# EAGLE schematic Final Thesis (EAGLE 7.5.0)
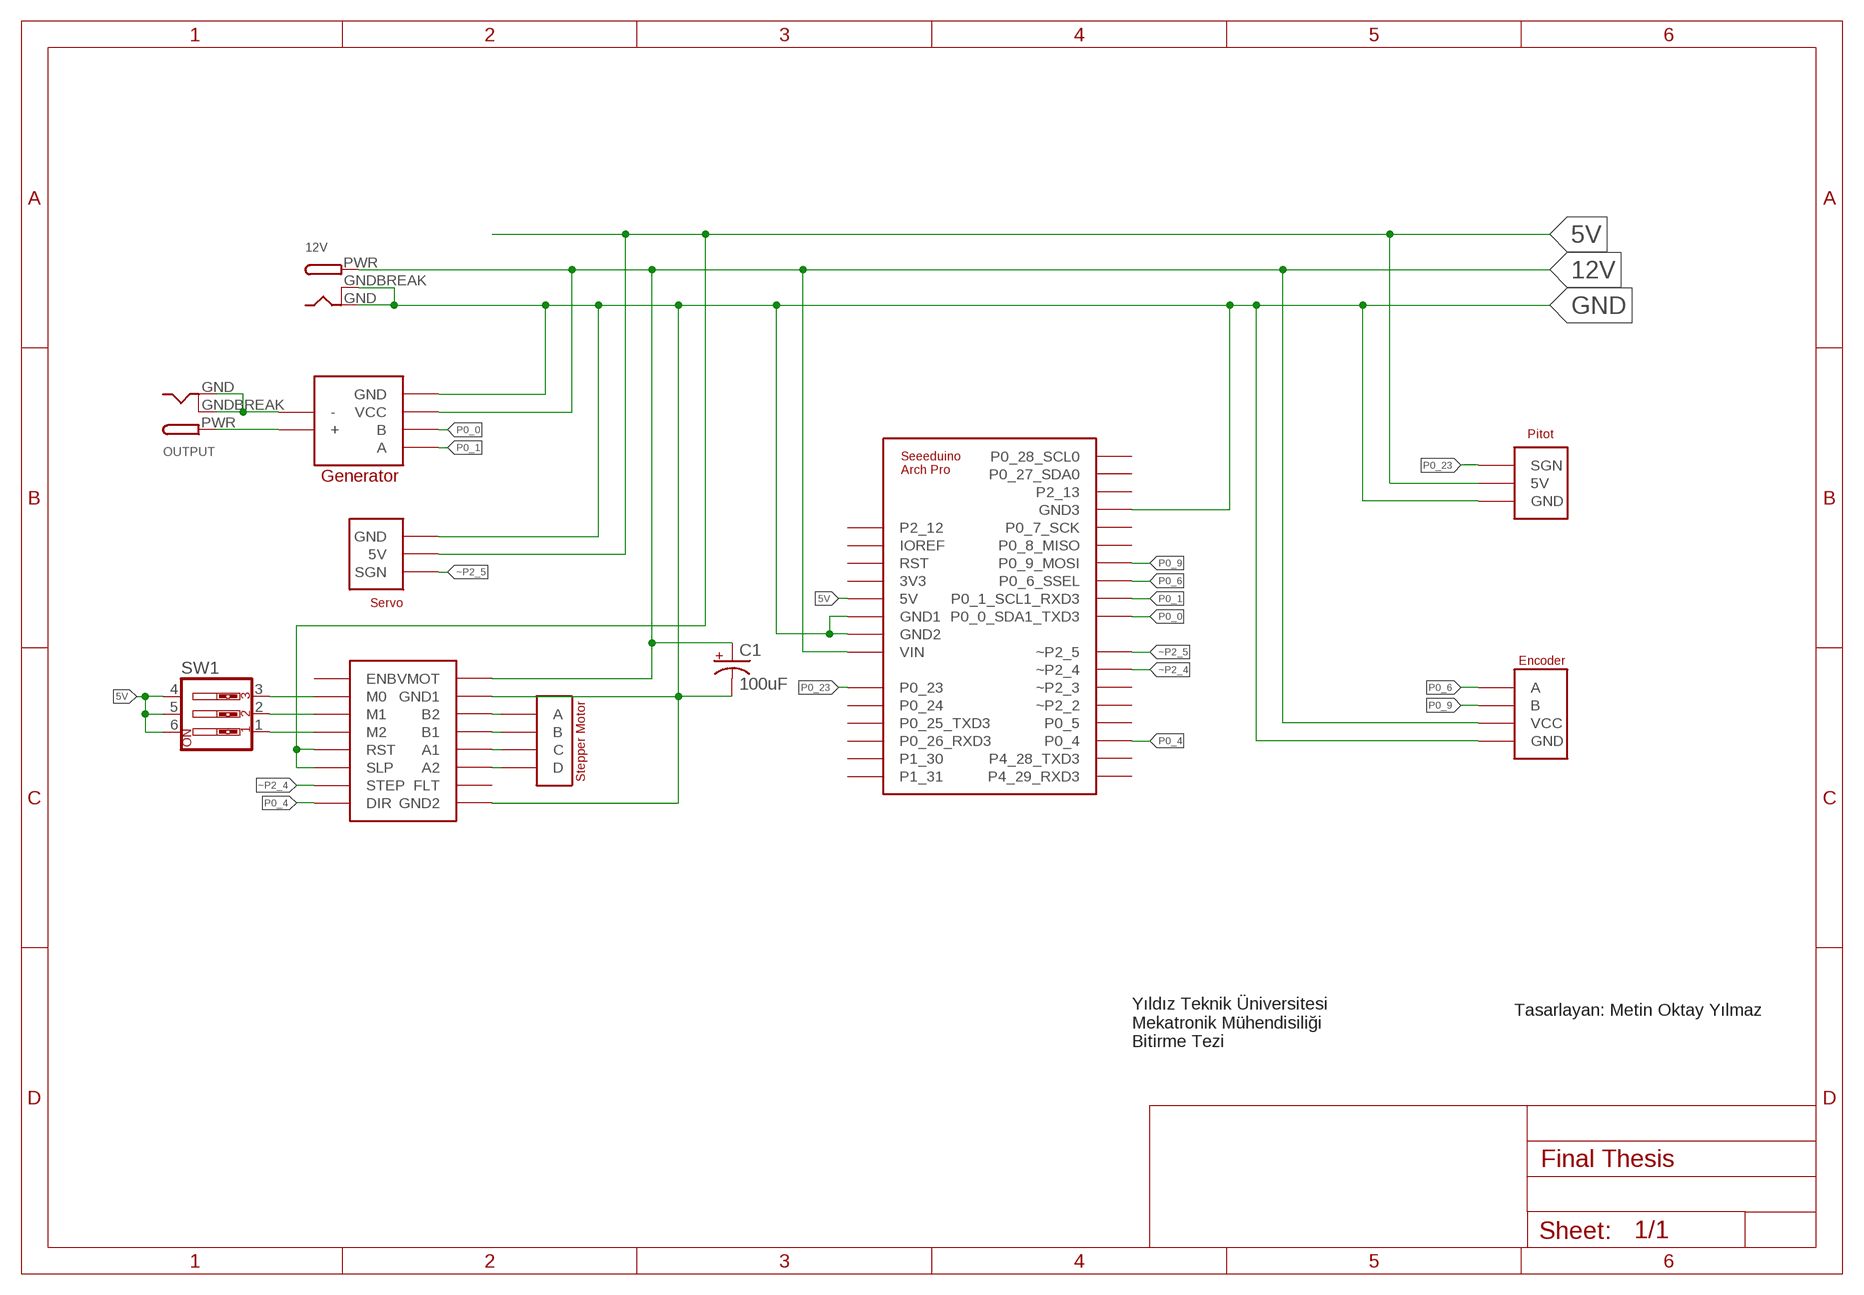
[diagram p0: schematic, sheet 1]

## Parts
12V  DCBARRELPTH  [DCJACK_2MM_PTH]
C1  100uF  CAP_POLPTH1  [CPOL-RADIAL-100UF-25V]
OUTPUT  DCBARRELPTH  [DCJACK_2MM_PTH]
SAP1  ARCH_PROSHIELD  [ARCH_PRO]
SW1  SW_DIP-3  [EDG-03]
U$1  ENCODER  [ENCODER]
U$2  GENERATOR  [GENERATOR]
U$3  PITOT  [PITOT]
U$4  SERVO  [SERVO]
U$5  STEPPER  [STEPPER]
U$6  STEPPER_DRIVER  [STEPPER_DRIVER]

## Nets
5V: SAP1.5V SW1.4 SW1.5 SW1.6 U$3.5V U$4.5V U$6.RST U$6.SLP
12V: 12V.PWR C1.1(+) SAP1.VIN U$1.VCC U$2.VCC U$6.VMOT
GND: 12V.GND 12V.GNDBREAK C1.2(-) SAP1.GND1 SAP1.GND2 SAP1.GND3 U$1.GND U$2.GND U$3.GND U$4.GND U$6.GND1(GND2) U$6.GND(GND1)
N$1: U$5.A U$6.B2
N$2: U$5.B U$6.B1
N$3: U$5.C U$6.A1
N$4: U$5.D U$6.A2
N$6: OUTPUT.PWR U$2.+
N$10: SW1.3 U$6.M0
N$12: SW1.2 U$6.M1
N$13: SW1.1 U$6.M2
N$15: OUTPUT.GND OUTPUT.GNDBREAK U$2.-
P0_0: SAP1.P0_0_SDA1_TXD3 U$2.B
P0_1: SAP1.P0_1_SCL1_RXD3 U$2.A
P0_4: SAP1.P0_4 U$6.DIR
P0_6: SAP1.P0_6_SSEL U$1.A
P0_9: SAP1.P0_9_MOSI U$1.B
P0_23: SAP1.P0_23 U$3.SGN
~P2_4: SAP1.~P2_4 U$6.STEP
~P2_5: SAP1.~P2_5 U$4.SGN
Unconnected: SAP1.3V3 SAP1.IOREF SAP1.P0_5 SAP1.P0_7_SCK SAP1.P0_8_MISO SAP1.P0_24 SAP1.P0_25_TXD3 SAP1.P0_26_RXD3 SAP1.P0_27_SDA0 SAP1.P0_28_SCL0 SAP1.P1_30 SAP1.P1_31 SAP1.P2_12 SAP1.P2_13 SAP1.P4_28_TXD3 SAP1.P4_29_RXD3 SAP1.RST SAP1.~P2_2 SAP1.~P2_3 U$6.ENB U$6.FLT

## Notes on the sheet
- Tasarlayan: Metin Oktay Yılmaz
- Yıldız Teknik Üniversitesi
  Mekatronik Mühendisiliği
  Bitirme Tezi

## Library data of the parts
12V OUTPUT = adafruit:DCBARREL: 2.0mm DC Barrel Jack DCJACK_2MM_PTH - Through Hole Jack (4UConnector: 05537)
C1 = SparkFun-Capacitors:CAP_POL: Capacitor Polarized These are standard SMD and PTH capacitors. Normally 10uF, 47uF, and 100uF in electrolytic and tantalum varieties. Always verify the external diameter of the through hole cap, it varies with capacity, voltage, and manufacturer. The EIA devices should be standard.
SAP1 = Final_Thesis:ARCH_PRO: Seeeduino Arch Pro Shield
SW1 = special:SW_DIP-3: DIP SWITCH
U$1 = Final_Thesis:ENCODER: Encoder connector
U$2 = Final_Thesis:GENERATOR: Generator connector
U$3 = Final_Thesis:PITOT: Pitot tube connector
U$4 = Final_Thesis:SERVO: Servo motor connector
U$5 = Final_Thesis:STEPPER: Stepper motor connector
U$6 = Final_Thesis:STEPPER_DRIVER